# Altium schematic sheet um232r.SchDoc
size A
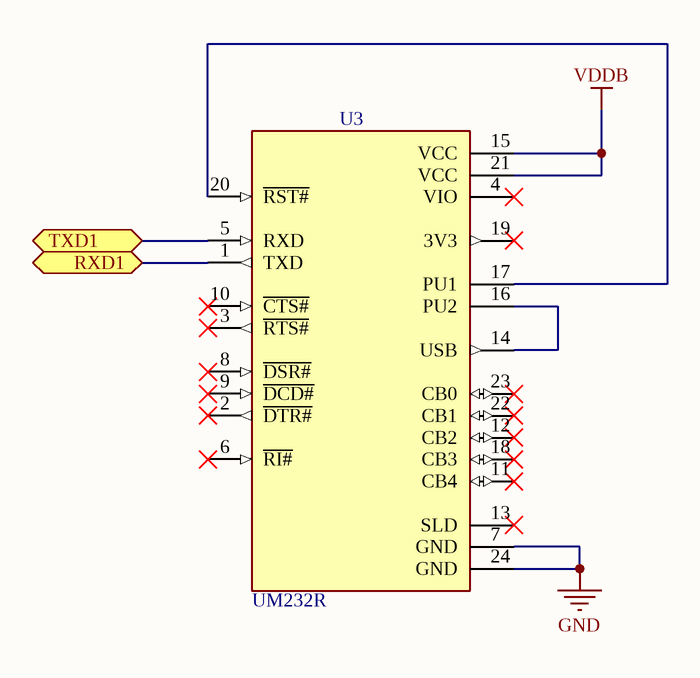
[diagram p0: um232r.SchDoc]

## Parts
U3  UM232R  [MODULE_UM232R]

## Ports
RXD1, TXD1

## Nets
GND: U3.7(GND) U3.24(GND)
VDDB: U3.15(VCC) U3.21(VCC)
RXD1: U3.1(TXD) ; port RXD1
TXD1: U3.5(RXD) ; port TXD1
NetU3_14: U3.14(USB) U3.16(PU2)
NetU3_17: U3.17(PU1) U3.20(~{RST#})

Not connected (* = marked no-connect by the designer): U3 2(~{DTR#})* 3(~{RTS#})* 4(VIO)* 6(~{RI#})* 8(~{DSR#})* 9(~{DCD#})* 10(~{CTS#})* 11(CB4)* 12(CB2)* 13(SLD)* 18(CB3)* 19(3V3)* 22(CB1)* 23(CB0)*

## Library data of the parts
U3 = UM232R: FT232R USB 2.0 to UART (RS232) Bridge Interface Evaluation Board; MF: FTDI,; Package: DIP-24 FTDI; MP: UM232R; Price: None; Availability: Unavailable; Value: *; SnapEDA_Link: https://www.snapeda.com/parts/UM232R/FTDI,%20Future%20Technology%20Devices%20International%20Ltd/view-part/424493/?ref=snap; BuyPart: https://www.snapeda.com/parts/UM232R/FTDI,%20Future%20Technology%20Devices%20International%20Ltd/view-part/424493/?ref=eda